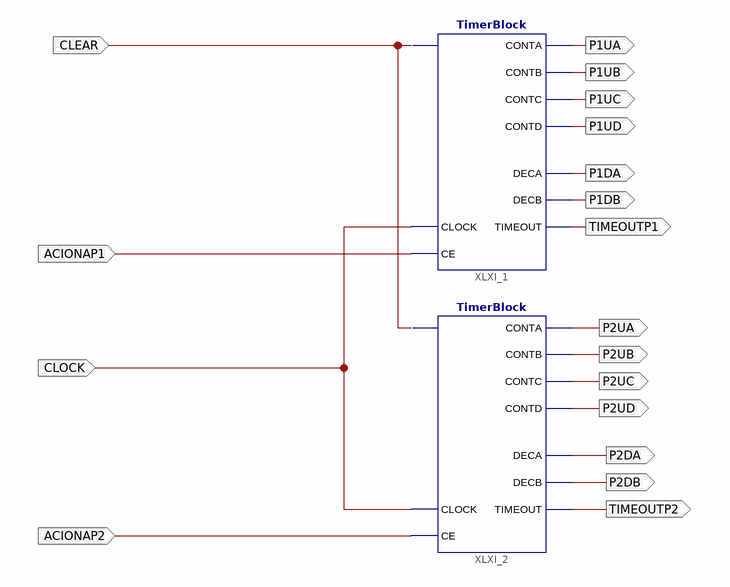
[diagram p0: schematic sheet 1]
// Xilinx ISE schematic Players.sch (spartan3) as structural Verilog: 2 symbols, 18 ports
module Players (
  input  CLEAR,
  input  ACIONAP1,
  input  ACIONAP2,
  input  CLOCK,
  output TIMEOUTP1,
  output P1UA,
  output P1UB,
  output P1UC,
  output P1UD,
  output P1DA,
  output P1DB,
  output P2UD,
  output P2UC,
  output P2UB,
  output P2UA,
  output P2DA,
  output P2DB,
  output TIMEOUTP2
);

  TimerBlock XLXI_1 (
    .CLEAR(CLEAR), .CLOCK(CLOCK), .CONTA(P1UA), .CONTB(P1UB), .CONTC(P1UC), .CONTD(P1UD), .DECA(P1DA),
    .DECB(P1DB), .TIMEOUT(TIMEOUTP1), .CE(ACIONAP1));
  TimerBlock XLXI_2 (
    .CLEAR(CLEAR), .CLOCK(CLOCK), .CONTA(P2UA), .CONTB(P2UB), .CONTC(P2UC), .CONTD(P2UD), .DECA(P2DA),
    .DECB(P2DB), .TIMEOUT(TIMEOUTP2), .CE(ACIONAP2));
endmodule
